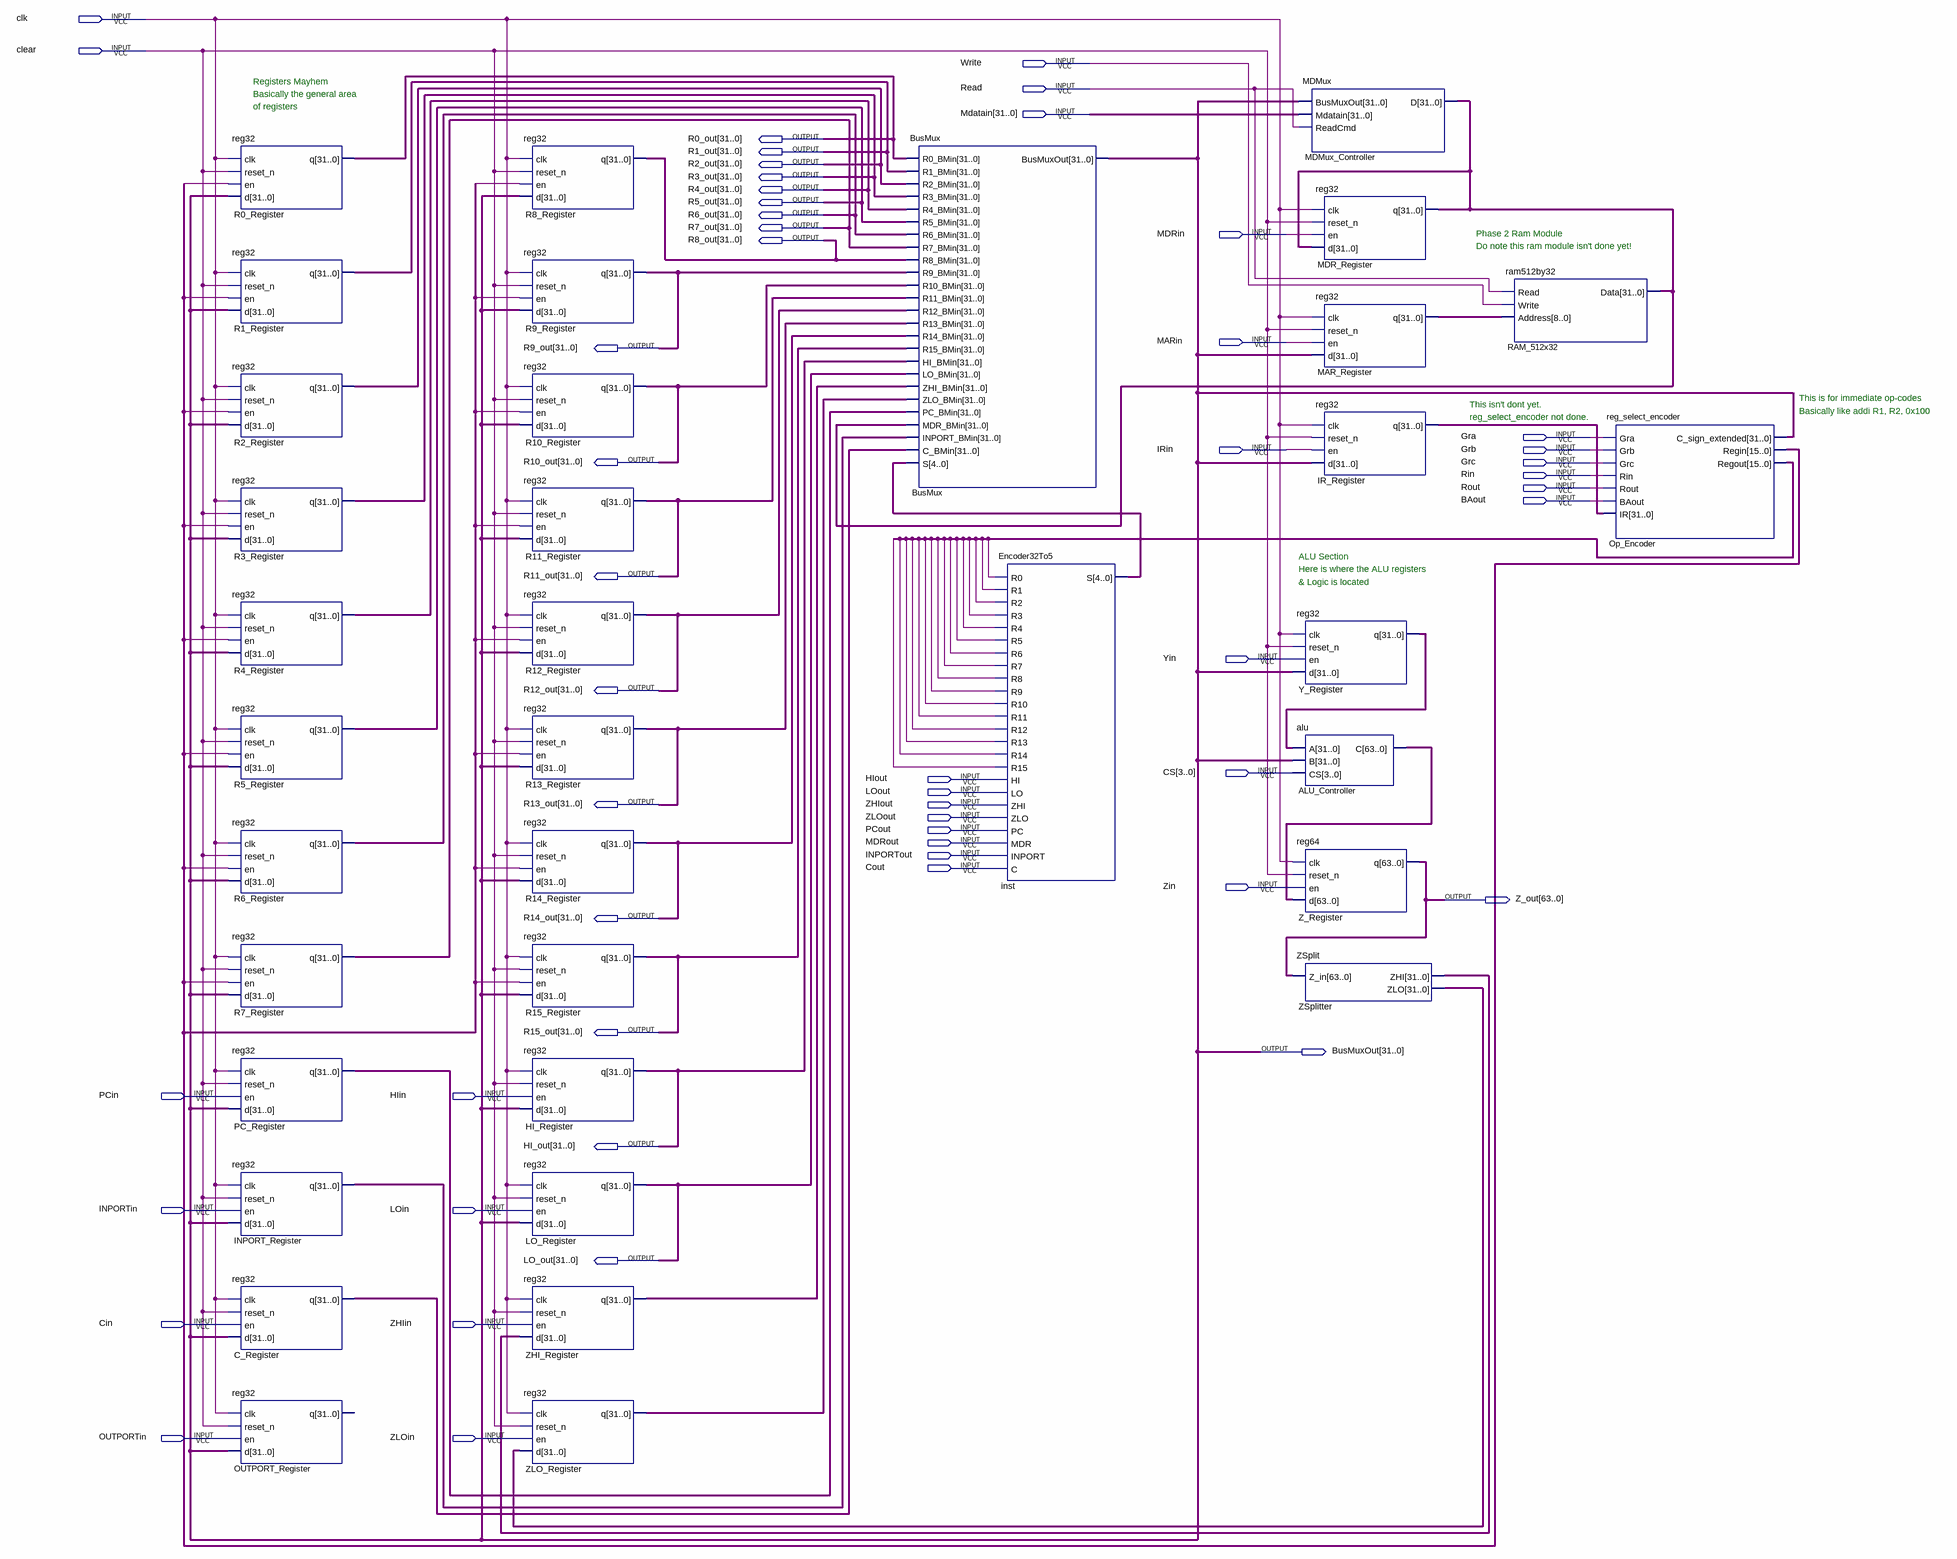
[diagram p0: schematic sheet]
// Quartus schematic phase2.bdf as structural Verilog: 36 symbols, 53 pins
module phase2 (
  input  clk,
  input  clear,
  input  Write,
  input  Read,
  input  [31:0] Mdatain,
  input  MDRin,
  input  MARin,
  input  Gra,
  input  IRin,
  input  Grb,
  input  Grc,
  input  Rin,
  input  Rout,
  input  BAout,
  input  Yin,
  input  [3:0] CS,
  input  HIout,
  input  LOout,
  input  ZHIout,
  input  ZLOout,
  input  PCout,
  input  MDRout,
  input  INPORTout,
  input  Cout,
  input  Zin,
  input  PCin,
  input  HIin,
  input  INPORTin,
  input  LOin,
  input  Cin,
  input  ZHIin,
  input  OUTPORTin,
  input  ZLOin,
  output [31:0] R0_out,
  output [31:0] R1_out,
  output [31:0] R2_out,
  output [31:0] R3_out,
  output [31:0] R4_out,
  output [31:0] R5_out,
  output [31:0] R6_out,
  output [31:0] R7_out,
  output [31:0] R8_out,
  output [31:0] R9_out,
  output [31:0] R10_out,
  output [31:0] R11_out,
  output [31:0] R12_out,
  output [31:0] R13_out,
  output [63:0] Z_out,
  output [31:0] R14_out,
  output [31:0] R15_out,
  output [31:0] BusMuxOut,
  output [31:0] HI_out,
  output [31:0] LO_out
);

  wire undriven, undriven_2, undriven_3, undriven_4, undriven_5, undriven_6, undriven_7, undriven_8,
       undriven_9, undriven_10, undriven_11, undriven_12, undriven_13, undriven_14, undriven_15, undriven_16,
       undriven_17, undriven_18, undriven_19, undriven_20, undriven_21, undriven_22, undriven_23,
       undriven_24, undriven_25, undriven_26, undriven_27, undriven_28, undriven_29, undriven_30,
       undriven_31, undriven_32;
  wire [4:0] inst_s;
  wire [15:0] Op_Encoder_regin, Op_Encoder_regout;
  wire [31:0] C_Register_q, INPORT_Register_q, IR_Register_q, MAR_Register_q, MDMux_Controller_d,
       PC_Register_q, Y_Register_q, ZHI_Register_q, ZLO_Register_q, ZSplitter_zhi, ZSplitter_zlo;
  wire [63:0] ALU_Controller_c;

  reg32 R0_Register (.clk(clk), .reset_n(clear), .en(undriven_9), .d(BusMuxOut), .q(R0_out));
  reg32 R1_Register (.clk(clk), .reset_n(clear), .en(undriven_10), .d(BusMuxOut), .q(R1_out));
  reg32 R2_Register (.clk(clk), .reset_n(clear), .en(undriven_11), .d(BusMuxOut), .q(R2_out));
  reg32 R3_Register (.clk(clk), .reset_n(clear), .en(undriven_12), .d(BusMuxOut), .q(R3_out));
  reg32 R4_Register (.clk(clk), .reset_n(clear), .en(undriven_13), .d(BusMuxOut), .q(R4_out));
  reg32 R5_Register (.clk(clk), .reset_n(clear), .en(undriven_14), .d(BusMuxOut), .q(R5_out));
  reg32 R6_Register (.clk(clk), .reset_n(clear), .en(undriven_15), .d(BusMuxOut), .q(R6_out));
  reg32 R7_Register (.clk(clk), .reset_n(clear), .en(undriven_16), .d(BusMuxOut), .q(R7_out));
  reg32 PC_Register (.clk(clk), .reset_n(clear), .en(PCin), .d(BusMuxOut), .q(PC_Register_q));
  reg32 INPORT_Register (.clk(clk), .reset_n(clear), .en(INPORTin), .d(BusMuxOut), .q(INPORT_Register_q));
  reg32 C_Register (.clk(clk), .reset_n(clear), .en(Cin), .d(BusMuxOut), .q(C_Register_q));
  reg32 OUTPORT_Register (.clk(clk), .reset_n(clear), .en(OUTPORTin), .d(BusMuxOut));  // open: q
  reg32 R8_Register (.clk(clk), .reset_n(clear), .en(undriven_8), .d(BusMuxOut), .q(R8_out));
  reg32 R9_Register (.clk(clk), .reset_n(clear), .en(undriven_7), .d(BusMuxOut), .q(R9_out));
  reg32 R10_Register (.clk(clk), .reset_n(clear), .en(undriven_6), .d(BusMuxOut), .q(R10_out));
  reg32 R11_Register (.clk(clk), .reset_n(clear), .en(undriven_5), .d(BusMuxOut), .q(R11_out));
  reg32 R12_Register (.clk(clk), .reset_n(clear), .en(undriven_4), .d(BusMuxOut), .q(R12_out));
  reg32 R13_Register (.clk(clk), .reset_n(clear), .en(undriven_3), .d(BusMuxOut), .q(R13_out));
  reg32 R14_Register (.clk(clk), .reset_n(clear), .en(undriven_2), .d(BusMuxOut), .q(R14_out));
  reg32 R15_Register (.clk(clk), .reset_n(clear), .en(undriven), .d(BusMuxOut), .q(R15_out));
  reg32 HI_Register (.clk(clk), .reset_n(clear), .en(HIin), .d(BusMuxOut), .q(HI_out));
  reg32 LO_Register (.clk(clk), .reset_n(clear), .en(LOin), .d(BusMuxOut), .q(LO_out));
  reg32 ZHI_Register (.clk(clk), .reset_n(clear), .en(ZHIin), .d(ZSplitter_zhi), .q(ZHI_Register_q));
  reg32 ZLO_Register (.clk(clk), .reset_n(clear), .en(ZLOin), .d(ZSplitter_zlo), .q(ZLO_Register_q));
  BusMux BusMux (
    .R0_BMin(R0_out), .R1_BMin(R1_out), .R2_BMin(R2_out), .R3_BMin(R3_out), .R4_BMin(R4_out),
    .R5_BMin(R5_out), .R6_BMin(R6_out), .R7_BMin(R7_out), .R8_BMin(R8_out), .R9_BMin(R9_out),
    .R10_BMin(R10_out), .R11_BMin(R11_out), .R12_BMin(R12_out), .R13_BMin(R13_out), .R14_BMin(R14_out),
    .R15_BMin(R15_out), .HI_BMin(HI_out), .LO_BMin(LO_out), .ZHI_BMin(ZHI_Register_q),
    .ZLO_BMin(ZLO_Register_q), .PC_BMin(PC_Register_q), .MDR_BMin(MDMux_Controller_d),
    .INPORT_BMin(INPORT_Register_q), .C_BMin(C_Register_q), .S(inst_s), .BusMuxOut(BusMuxOut));
  Encoder32To5 inst (
    .R0(undriven_17), .R1(undriven_18), .R2(undriven_19), .R3(undriven_20), .R4(undriven_21),
    .R5(undriven_22), .R6(undriven_23), .R7(undriven_24), .R8(undriven_25), .R9(undriven_26),
    .R10(undriven_27), .R11(undriven_28), .R12(undriven_29), .R13(undriven_30), .R14(undriven_31),
    .R15(undriven_32), .HI(HIout), .LO(LOout), .ZHI(ZHIout), .ZLO(ZLOout), .PC(PCout), .MDR(MDRout),
    .INPORT(INPORTout), .C(Cout), .S(inst_s));
  MDMux MDMux_Controller (.BusMuxOut(BusMuxOut), .Mdatain(Mdatain), .ReadCmd(Read), .D(MDMux_Controller_d));
  reg32 MDR_Register (.clk(clk), .reset_n(clear), .en(MDRin), .d(MDMux_Controller_d), .q(MDMux_Controller_d));
  reg32 MAR_Register (.clk(clk), .reset_n(clear), .en(MARin), .d(BusMuxOut), .q(MAR_Register_q));
  reg32 IR_Register (.clk(clk), .reset_n(clear), .en(IRin), .d(BusMuxOut), .q(IR_Register_q));
  reg32 Y_Register (.clk(clk), .reset_n(clear), .en(Yin), .d(BusMuxOut), .q(Y_Register_q));
  alu ALU_Controller (.A(Y_Register_q), .B(BusMuxOut), .CS(CS), .C(ALU_Controller_c));
  reg64 Z_Register (.clk(clk), .reset_n(clear), .en(Zin), .d(ALU_Controller_c), .q(Z_out));
  ZSplit ZSplitter (.Z_in(Z_out), .ZHI(ZSplitter_zhi), .ZLO(ZSplitter_zlo));
  ram512by32 RAM_512x32 (.Read(Read), .Write(Write), .Address(MAR_Register_q), .Data(MDMux_Controller_d));
  reg_select_encoder Op_Encoder (
    .Gra(Gra), .Grb(Grb), .Grc(Grc), .Rin(Rin), .Rout(Rout), .BAout(BAout), .IR(IR_Register_q),
    .C_sign_extended(BusMuxOut), .Regin(Op_Encoder_regin), .Regout(Op_Encoder_regout));

  // Notes on the sheet:
  //   Registers Mayhem
  //   Basically the general area
  //   of registers
  //   Phase 2 Ram Module
  //   Do note this ram module isn't done yet!
  //   This is for immediate op-codes
  //   This isn't dont yet.
  //   Basically like addi R1, R2, 0x100
  //   reg_select_encoder not done.
  //   ALU Section
  //   Here is where the ALU registers
  //   & Logic is located
endmodule
